# EAGLE schematic controller_board (EAGLE 7.1.0)
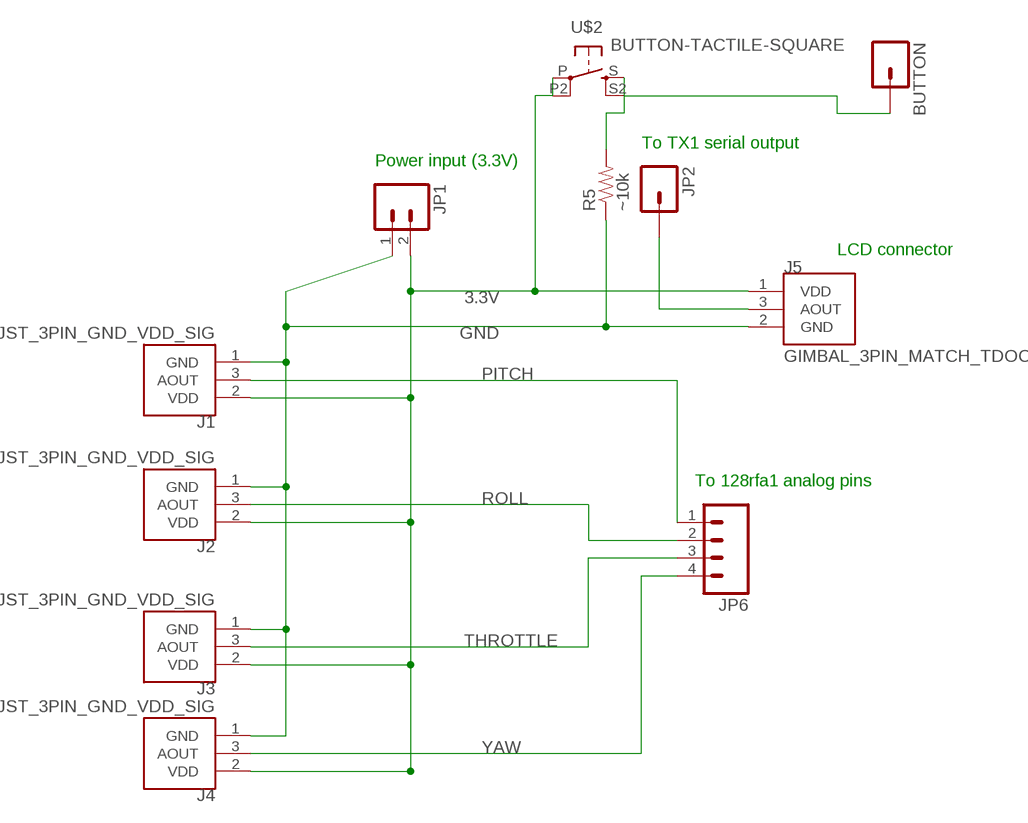
[diagram p0: schematic, sheet 1]

## Parts
BUTTON  M01PTH  [1X01]
J1  JST_3PIN_GND_VDD_SIG  [JST-3-PTH-REVERSE]
J2  JST_3PIN_GND_VDD_SIG  [JST-3-PTH-REVERSE]
J3  JST_3PIN_GND_VDD_SIG  [JST-3-PTH-REVERSE]
J4  JST_3PIN_GND_VDD_SIG  [JST-3-PTH-REVERSE]
J5  GIMBAL_3PIN_MATCH_TDOCU  [JST-3-PTH]
JP1  M021X02_NO_SILK  [1X02_NO_SILK]
JP2  M01PTH  [1X01]
JP6  M04PTH  [1X04]
R5  ~10k  RESISTORPTH-1/4W  [AXIAL-0.4]
U$2  BUTTON-TACTILE-SQUARE  [BUTTON-TACTILE-SQUARE-ADAFRUIT1010]

## Nets
3.3V: J1.2(VDD) J2.2(VDD) J3.2(VDD) J4.2(VDD) J5.1(VDD) JP1.2 U$2.P U$2.P2(P1)
GND: J1.1(GND) J2.1(GND) J3.1(GND) J4.1(GND) J5.2(GND) JP1.1 R5.P$1
N$6: BUTTON.1 R5.P$2 U$2.S U$2.S2(S1)
N$9: J5.3(AOUT) JP2.1
PITCH: J1.3(AOUT) JP6.1
ROLL: J2.3(AOUT) JP6.2
THROTTLE: J3.3(AOUT) JP6.3
YAW: J4.3(AOUT) JP6.4

## Notes on the sheet
- To TX1 serial output
- Power input (3.3V)
- LCD connector
- To 128rfa1 analog pins

## Library data of the parts
BUTTON JP2 = SparkFun-Connectors:M01: Header 1 Standard 1-pin 0.1" header. Use with straight break away headers (SKU : PRT-00116), right angle break away headers (PRT-00553), swiss pins (PRT-00743), machine pins (PRT-00117), and female headers (PRT-00115).
J1-J4 = Controller:JST_3PIN_GND_VDD_SIG
J5 = Controller:GIMBAL_3PIN_MATCH_TDOCU
JP1 = SparkFun-Connectors:M02: Standard 2-pin 0.1" header. Use with - straight break away headers ( PRT-00116) - right angle break away headers (PRT-00553) - swiss pins (PRT-00743) - machine pins (PRT-00117) - female headers (PRT-00115) Molex polarized connector foot print use with: PRT-08233 with associated crimp pins and housings. 2.54_SCREWTERM for use with PRT-10571. 3.5mm Screw Terminal footprints for PRT-08084 5mm Screw Terminal footprints for use with PRT-08432
JP6 = SparkFun-Connectors:M04: Header 4 Standard 4-pin 0.1" header. Use with straight break away headers (SKU : PRT-00116), right angle break away headers (PRT-00553), swiss pins (PRT-00743), machine pins (PRT-00117), and female headers (PRT-00115). Molex polarized connector foot print use with SKU : PRT-08231 with associated crimp pins and housings. 1MM SMD Version SKU: PRT-10208
R5 = SparkFun-Resistors:RESISTOR: Resistor Basic schematic elements and footprints for 0603, 1206, and PTH resistors.
U$2 = Controller:BUTTON-TACTILE